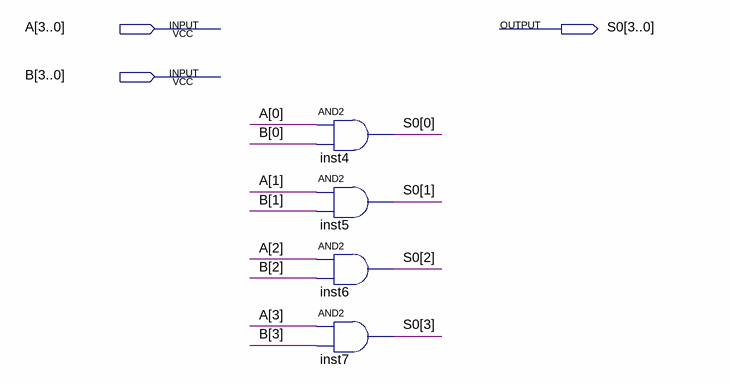
[diagram p0: schematic sheet]
// Quartus schematic AND4b.bdf as structural Verilog: 4 symbols, 3 pins
module AND4b (
  input  [3:0] A,
  input  [3:0] B,
  output [3:0] S0
);

  and inst4 (S0[0], A[0], B[0]);
  and inst5 (S0[1], A[1], B[1]);
  and inst6 (S0[2], A[2], B[2]);
  and inst7 (S0[3], A[3], B[3]);
endmodule
